# EAGLE design cam_switch nobec (EAGLE 9.3.1)
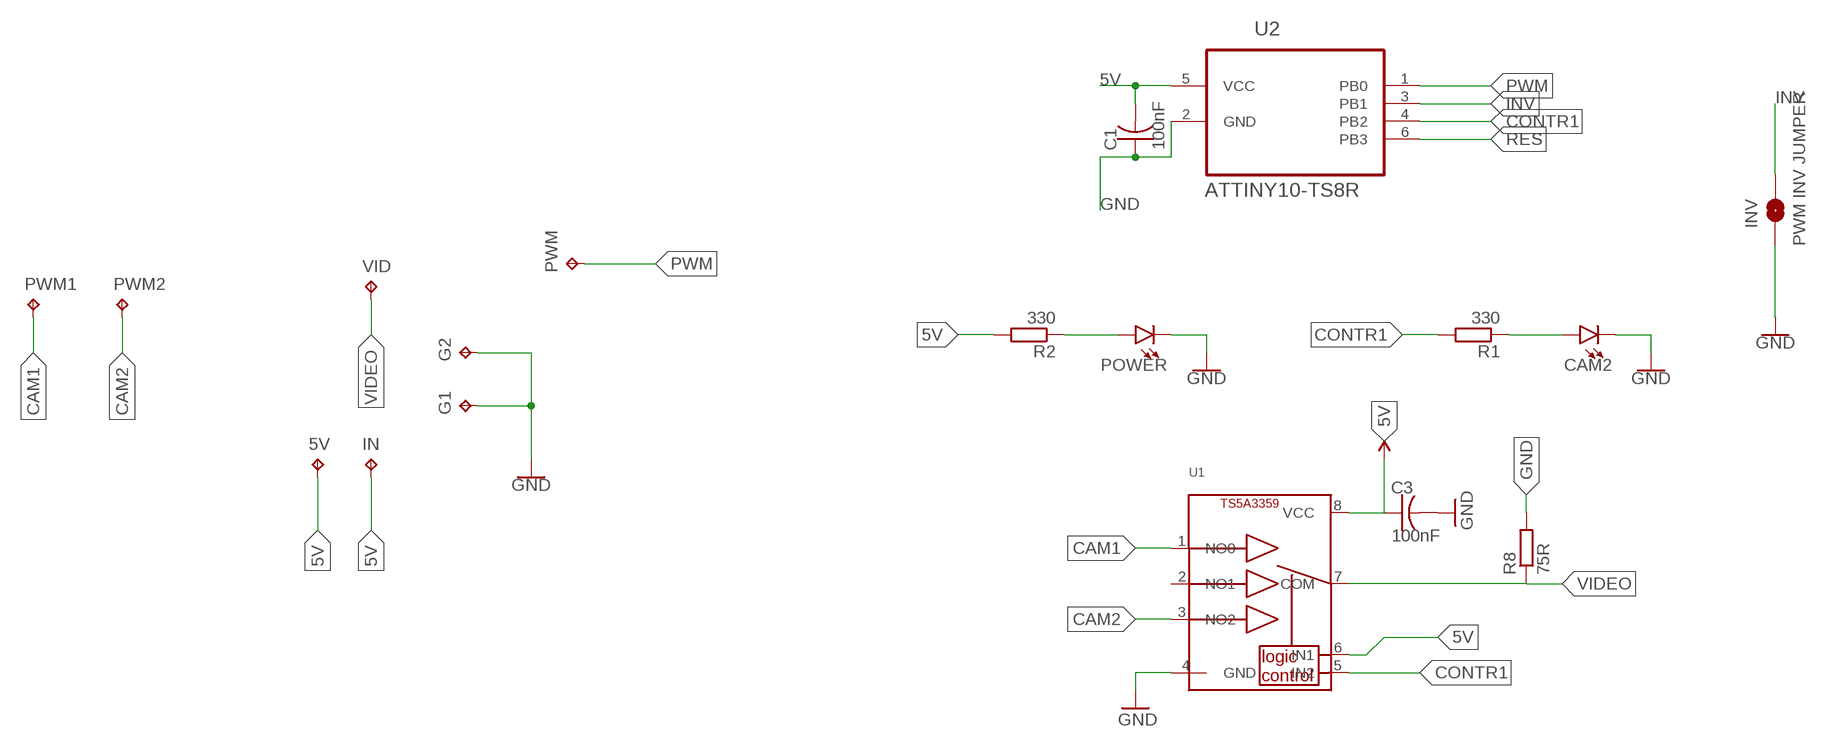
[diagram p0: schematic, sheet 1]

## Parts
5V  TPTP20SQ  [TP20SQ]
C1  100nF  C-USC0603  [C0603]
C3  100nF  C-USC0603  [C0603]
CAM2  LED0603  [LED-0603]
G1  TPTP20SQ  [TP20SQ]
G2  TPTP20SQ  [TP20SQ]
IN  TPTP20SQ  [TP20SQ]
INV  PWM INV JUMPER  JUMPER-SMT_2_NO_NO-SILK  [SMT-JUMPER_2_NO_NO-SILK]
POWER  LED0603  [LED-0603]
PWM  TPTP20SQ  [TP20SQ]
PWM1  TPTP20SQ  [TP20SQ]
PWM2  TPTP20SQ  [TP20SQ]
R1  330  R-EU_R0603  [R0603]
R2  330  R-EU_R0603  [R0603]
R8  75R  R-EU_R0603  [R0603]
U1  TS5A3359  [VFSOP-8]
U2  ATTINY10-TS8R  [SOT95P280X145-6N]
VID  TPTP20SQ  [TP20SQ]

## Nets
5V: 5V.TP C1.2 C3.1 IN.TP R2.2 U1.6(IN1) U1.8(VCC) U2.5(VCC) ; supply symbol labelled VCC
CAM1: PWM1.TP U1.1(NO0)
CAM2: PWM2.TP U1.3(NO2)
CONTR1: R1.2 U1.5(IN2) U2.4(PB2)
GND: C1.1 C3.2 CAM2.C G1.TP G2.TP INV.1 POWER.C R8.2 U1.4(GND) U2.2(GND)
INV: INV.2 U2.3(PB1)
N$1: CAM2.A R1.1
N$2: POWER.A R2.1
PWM: PWM.TP U2.1(PB0)
RES: U2.6(PB3)
VIDEO: R8.1 U1.7(COM) VID.TP
Unconnected: U1.2(NO1)

## Library data of the parts
5V G1 G2 IN PWM PWM1 PWM2 VID = testpad:TP: Test pad
C1 C3 = adafruit:C-US: CAPACITOR, American symbol
CAM2 POWER = SparkFun-LED:LED: LED (Generic) Standard schematic elements and footprints for 5mm, 3mm, 1206, and 0603 sized LEDs. Generic LEDs with no color specified.
INV = SparkFun-Jumpers:JUMPER-SMT_2_NO: Normally open jumper This jumper has two pads in close proximity to each other. Apply solder to close the connection. Round pads are easier to solder for beginners, but are a lot larger. SparkFun Product that uses the round pads: SparkFun EL Sequencer <https://www.sparkfun.com/products/12781>
R1 R2 R8 = resistor:R-EU_: RESISTOR, European symbol
U1 = ts5a3359:TS5A3359: 74AUP2G126 - Low-Power Dual Tri-State Buffer OE high enables output. For OE Low enabled output use 74AUP2G125. VCC: 0.8-3.6V Temp: -40°C - 125°C Package Variant: 8-VSSOP (SOT765-1) Manuf. ID: 74AUP2G126DC,125 Digikey: 568-4987-1-ND NOTE: Make sure to check the propogation delay to see if it's short enough for your timing since it's largely dependant on the line capacitance and supply voltage!
U2 = ATTINY10-TS8R:ATTINY10-TS8R: 8-bit Microcontroller with In-System Programmable Flash; AVAILABILITY: Unavailable; DESCRIPTION: Embedded microcontroller ATTINY10-TS8R SOT 23 Microchip Technology 8-Bit 10 MHz I/O number 4; MF: Microchip; MP: ATTINY10-TS8R; PACKAGE: SOT-23-6 Microchip; PRICE: None

## Net classes
1 vcc: width 0.5 mm, clearance 0.381 mm

## Board
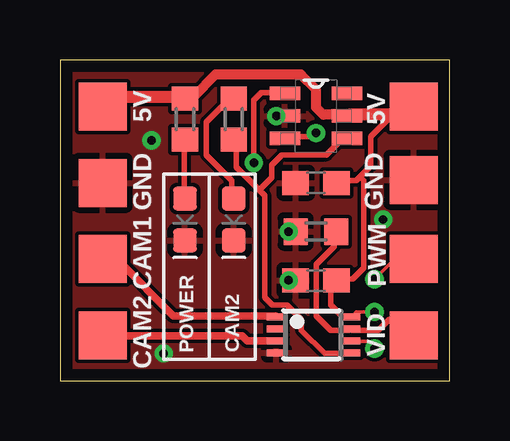
[diagram p1: board, top side]
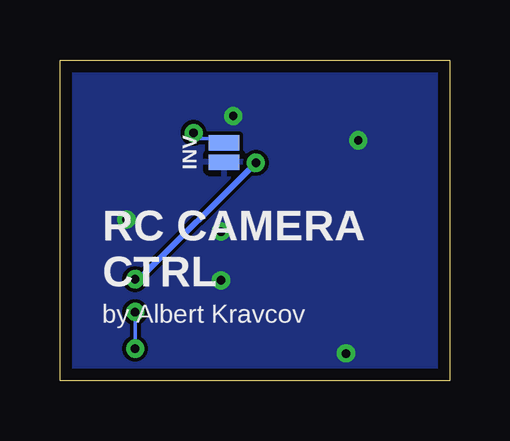
[diagram p2: board, bottom side, seen from below]

Size 16.24 x 13.39 mm. Coordinates in mm from the lower left corner, seen from the top.
Outline: 0,0 16.24,0 16.24,13.39 0,13.39 0,0
Copper layers (1*16): Top 0.035mm / dielectric 1.5mm / Bottom 0.035mm
Design rules "default *": minimum track width 6mil, minimum drill 0.35mm, track to track 6mil, track to pad 6mil, pad to pad 6mil, via to via 6mil, smd to smd 6mil, copper to edge 0.5mm, drill to drill 6mil, minimum pad ring 10mil, minimum via ring 8mil, stop-mask expansion 4mil, vias tented up to drill 2mm, thermal gap 10mil

### Footprints (pad centres in the part's own frame; a part is rotated, then mirrored left to right if it is on the bottom)
TP20SQ = smd 2 x 2: TP 0,0
C0603 = smd 1.1 x 1: 1 -0.85,0; 2 0.85,0
LED-0603 = smd 1 x 1: A -0.877,0; C 0.877,0
SMT-JUMPER_2_NO_NO-SILK = smd 0.635 x 1.27: 1 -0.406,0; 2 0.406,0
R0603 = smd 1 x 1.1: 1 -0.85,0; 2 0.85,0
VFSOP-8 = smd 0.3 x 0.8: 1 0,0; 2 0.5,0; 3 1,0; 4 1.5,0; 5 1.5,3.1; 6 1,3.1; 7 0.5,3.1; 8 0,3.1
SOT95P280X145-6N = smd 1.27 x 0.559: 1 -1.295,0.94; 2 -1.295,0; 3 -1.295,-0.94; 4 1.295,-0.94; 5 1.295,0; 6 1.295,0.94

### Placement (x,y rotation side)
5V  14.73,11.43 90 top
C1  10.67,8.25 0 top
C3  10.67,4.19 180 top
CAM2  7.24,6.73 270 top
G1  1.78,8.25 0 top
G2  14.73,8.38 0 top
IN  1.78,11.43 0 top
INV  9.4,9.53 90 bottom
POWER  5.21,6.73 270 top
PWM  14.73,5.08 0 top
PWM1  1.78,5.08 0 top
PWM2  1.78,1.91 0 top
R1  7.24,10.92 270 top
R2  5.21,10.92 90 top
R8  10.67,6.22 180 top
U1  9.02,2.67 270 top
U2  10.67,11.05 0 top
VID  14.73,1.91 0 top

### Tracks (layer width: path | path; a pad name or v marks a point on that pad's centre or on a via)
5V  (via drill 0.35)
  Top 0.152: 2.13,11.86 1.83,11.56 IN.TP | 5.18,11.86 R2.2 5.33,11.86 | 11.73,2.72 12.04,2.72 U1.8 12.19,2.72 12.34,2.87 v13.11,2.87 | 11.28,3.94 11.43,4.09 C3.1 11.58,4.24 | 14.02,11.25 14.17,11.41 14.63,11.41 5V.TP 14.02,11.25 | 11.58,8.36 C1.2 | 13.72,11.1 13.87,11.25 14.02,11.25 | 12.04,11.1 U2.5 11.89,11.1 | v13.11,1.35 12.8,1.65 12.19,1.65 U1.6
  Top 0.229: 11.73,2.72 11.28,3.17 11.28,3.94 | 11.58,8.36 12.34,8.36 12.5,8.51 | 12.5,8.51 12.95,8.97 12.95,10.19 14.02,11.25 | 11.58,4.24 12.19,4.24 12.65,4.7 12.65,8.36 12.5,8.51
  Top 0.305: 5.56,11.86 5.33,11.86
  Top 0.406: 5.56,11.86 6.48,12.78 10.03,12.78 10.67,12.14 10.67,11.41 10.97,11.1 11.89,11.1
  Top 0.508: 2.13,11.86 5.18,11.86 | 13.72,11.1 12.04,11.1
  Bottom 0.152: v13.11,2.87 v13.11,1.35
CAM1
  Top 0.152: 2.44,5 1.83,5 PWM1.TP | 8.99,2.72 U1.1
  Top 0.305: 8.99,2.72 4.72,2.72 2.44,5
CAM2
  Top 0.305: PWM2.TP 1.8,1.88 7.59,1.88 7.8,1.67 U1.3
CONTR1
  Top 0.152: 7.34,10.01 7.32,10.03 R1.2 | 11.79,10.11 U2.4
  Top 0.229: 8.29,7.96 7.34,8.92 7.34,10.01 | 8.29,7.96 8.53,7.72 8.53,3.48 8.84,3.17 9.45,3.17 10.06,2.56 10.06,2.11 11.02,1.14 12.1,1.14 U1.5 | 11.79,10.11 11.1,9.42 9.25,9.42 8.81,8.99 8.81,8.48 8.29,7.96
GND  (via drill 0.35)
  other vias: 4.32,1.14 3.81,10.03 13.46,6.73 9.02,11.05 9.52,6.22 9.52,4.19
  pour Top: -7.11,15.11 18.29,15.11 18.29,-2.67 -7.11,-2.67
  pour Bottom: -5.84,13.84 17.02,13.84 17.02,-1.4 -5.84,-1.4
INV  (via drill 0.35)
  Top 0.152: 9.45,10.19 U2.3
  Top 0.229: 9.45,10.19 10.52,10.19 v10.67,10.34
  Bottom 0.152: v10.67,10.34 10.44,10.11 9.58,10.11 INV.2
N$1
  Top 0.152: 7.16,7.75 CAM2.A | 7.16,11.86 R1.1
  Top 0.229: 7.16,7.75 7.16,8.36 6.1,9.42 6.1,10.8 7.16,11.86
N$2
  Top 0.152: 5.18,7.75 POWER.A | 5.18,10.03 R2.1
  Top 0.229: 5.18,10.03 5.18,7.75
PWM  (via drill 0.35)
  Top 0.152: v13.11,4.24 13.87,5 14.63,5 PWM.TP | 9.3,12.01 U2.1
  Top 0.229: 9.3,12.01 8.38,12.01 8.08,11.71 v8.08,9.09
  Bottom 0.152: v13.11,4.24 12.93,4.24
  Bottom 0.229: 12.93,4.24 v8.08,9.09
VIDEO
  Top 0.152: 14.02,2.56 14.63,1.96 VID.TP | 12.19,2.11 U1.7 12.04,2.11 | 11.43,6.22 R8.1
  Top 0.229: 12.19,2.11 13.26,2.11 13.72,2.56 14.02,2.56 | 11.43,6.22 11.43,5.61 10.67,4.85 10.67,2.72 11.28,2.11 12.04,2.11

### Text on the board
tNames: 5V | GND | GND | CAM1 | PWM | CAM2
bNames: RC CAMERA / CTRL | by Albert Kravcov